# Altium schematic sheet Main Circuit Schematic.SchDoc
size A4; SheetNumber: 1; SheetTotal: 1
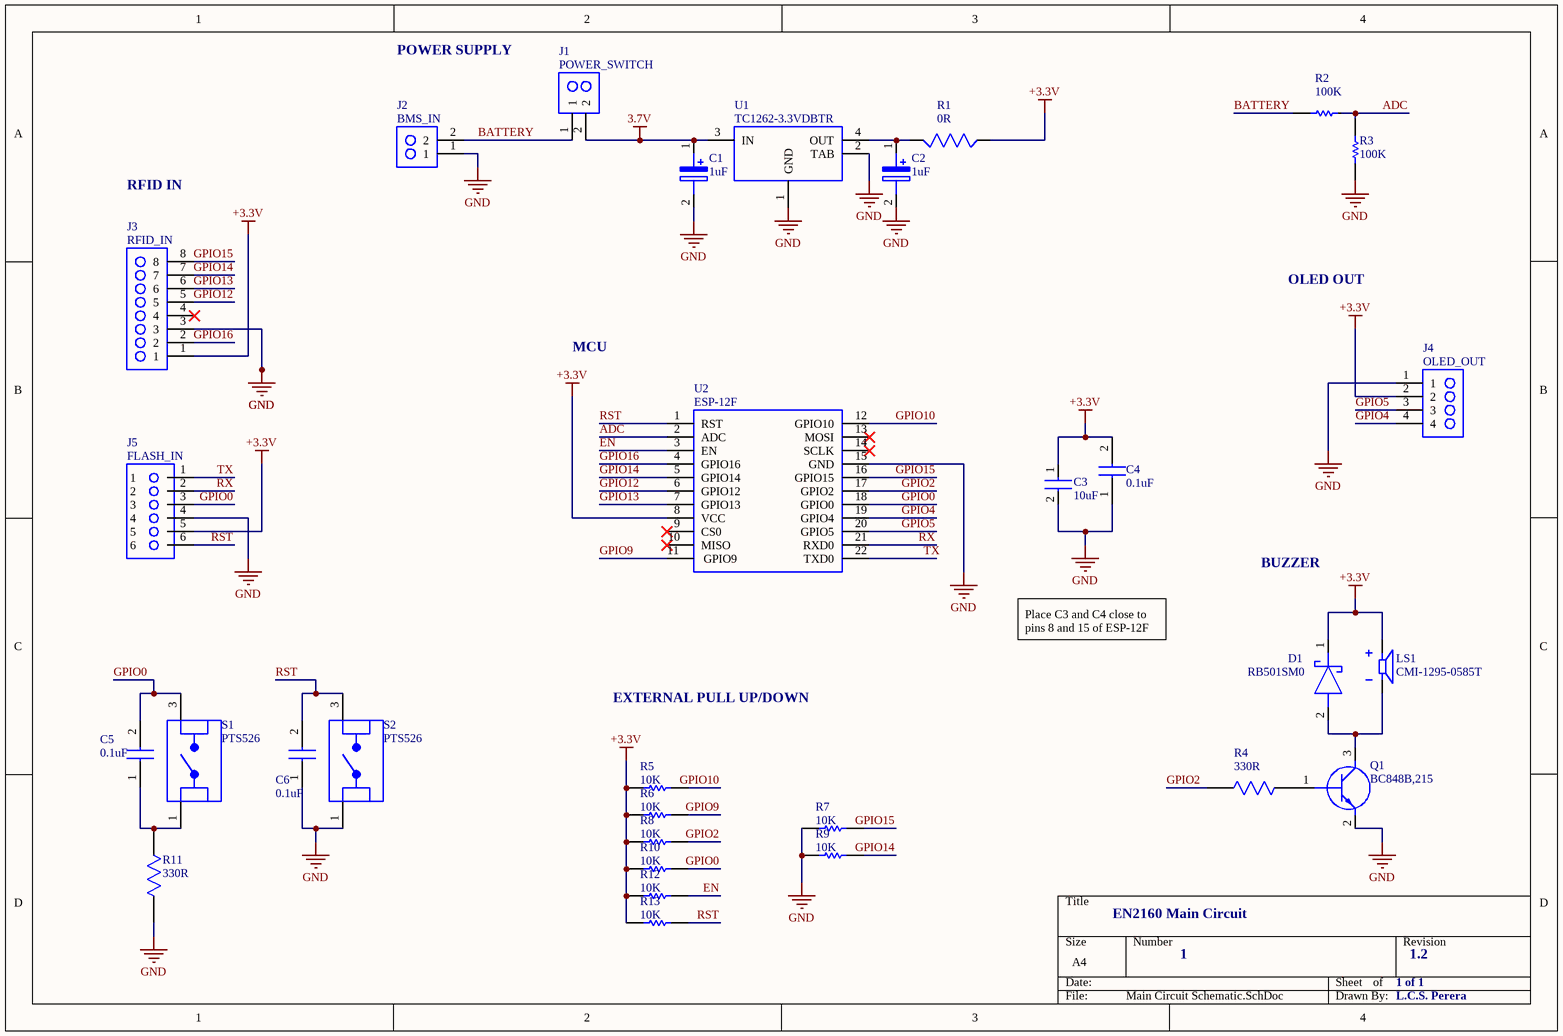
[diagram p0: Main Circuit Schematic.SchDoc]

## Parts
C1  1uF  [1U]
C2  1uF  [1U]
C3  10uF  [10ucer]
C4  0.1uF  [100n]
C5  0.1uF  [100n]
C6  0.1uF  [100n]
D1  RB501SM0  [Shottkey]
J1  POWER_SWITCH  [2jst]
J2  BMS_IN  [2jst]
J3  RFID_IN  [8x1]
J4  OLED_OUT  [4x1]
J5  FLASH_IN  [6x1]
LS1  CMI-1295-0585T  [BUZZER]
Q1  BC848B,215  [BC8488]
R1  0R  [0ohm]
R2  100K  [100k]
R3  100K  [100k]
R4  330R  [330r]
R5  10K  [10k]
R6  10K  [10k]
R7  10K  [10k]
R8  10K  [10k]
R9  10K  [10k]
R10  10K  [10k]
R11  330R  [330r]
R12  10K  [10k]
R13  10K  [10k]
S1  PTS526  [switch]
S2  PTS526  [switch]
U1  TC1262-3.3VDBTR  [3v3]
U2  ESP-12F  [esp12f]

## Nets
3.7V: C1.1(+) J1.2 U1.3(IN)
+3.3V: C3.1 C4.2 D1.1(K) J3.1 J4.2 J5.5 LS1.P R1.2 R5.1 R6.1 R8.1 R10.1 R12.1 R13.1 U2.8(VCC)
GND: C1.2(-) C2.2(-) C3.2 C4.1 C6.1 J2.1 J3.3 J4.1 J5.4 Q1.2(E) R3.1 R7.1 R9.1 R11.2 S2.1(COM_1) U1.1(GND) U1.2(TAB) U2.15(GND)
ADC: R2.1 R3.2 U2.2(ADC)
BATTERY: J1.1 J2.2 R2.2
EN: R12.2 U2.3(EN)
GPIO0: C5.2 J5.3 R10.2 S1.3(NO_1) U2.18(GPIO0)
GPIO2: R4.2 R8.2 U2.17(GPIO2)
GPIO4: J4.4 U2.19(GPIO4)
GPIO5: J4.3 U2.20(GPIO5)
GPIO9: R6.2 U2.11(GPIO9)
GPIO10: R5.2 U2.12(GPIO10)
GPIO12: J3.5 U2.6(GPIO12)
GPIO13: J3.6 U2.7(GPIO13)
GPIO14: J3.7 R9.2 U2.5(GPIO14)
GPIO15: J3.8 R7.2 U2.16(GPIO15)
GPIO16: J3.2 U2.4(GPIO16)
RST: C6.2 J5.6 R13.2 S2.3(NO_1) U2.1(RST)
RX: J5.2 U2.21(RXD0)
TX: J5.1 U2.22(TXD0)
NetC2_1: C2.1(+) R1.1 U1.4(OUT)
NetC5_1: C5.1 R11.1 S1.1(COM_1)
NetD1_2: D1.2(A) LS1.N Q1.3(C)
NetQ1_1: Q1.1(B) R4.1

Not connected (* = marked no-connect by the designer): J3 4*; U2 9(CS0)* 10(MISO)* 13(MOSI)* 14(SCLK)*

## Notes on the sheet
- POWER SUPPLY
- RFID IN
- OLED OUT
- MCU
- BUZZER
- Place C3 and C4 close to pins 8 and 15 of ESP-12F
- EXTERNAL PULL UP/DOWN
- EN2160 Main Circuit
- 1
- 1 of 1
- 1.2
- L.C.S. Perera

## Library data of the parts
C1 C2 = TAJA105K016RNJ: Capacitor Polarised; Manufacturer_Name: Kyocera AVX; Datasheet Link: http://www.farnell.com/datasheets/1680476.pdf; Height: 1.8mm; Manufacturer_Part_Number: TAJA105K016RNJ; Mouser Part Number: 581-TAJA105K016; Mouser Price/Stock: https://www.mouser.co.uk/ProductDetail/AVX/TAJA105K016RNJ?qs=OVpPYgiJXXWzOIbDvQCr4Q%3D%3D; Arrow Part Number: TAJA105K016RNJ; Arrow Price/Stock: https://www.arrow.com/en/products/taja105k016rnj/avx
C3 = 10uF: 10ÂµF Â±10% 10V Ceramic Capacitor X5R 0805 (2012 Metric); MF: Samsung Electro-Mechanics; MP: CL21A106KPFNNNG; SnapEDA_Link: https://www.snapeda.com/parts/CL21A106KPFNNNG/Samsung%20Electro-Mechanics/view-part/3598324/?ref=snap; Value: *; Arrow_Electronics-Purchase-URL: https://snapeda.com/shop?store=Arrow+Electronics&id=3598324; Digi-Key_Part_Number: 1276-6456-1-ND; Mouser-Purchase-URL: https://snapeda.com/shop?store=Mouser&id=3598324; Package: 0805 Samsung; DigiKey-Purchase-URL: https://snapeda.com/shop?store=DigiKey&id=3598324
C4-C6 = 0.1uF: Capacitor; Manufacturer_Name: KEMET; Manufacturer_Part_Number: C0603C104K1RACTU; Datasheet Link: https://search.kemet.com/component-documentation/download/specsheet/C0603C104K1RACTU; Height: 0.95mm; Mouser Part Number: 80-C0603C104K1RACTU; Mouser Price/Stock: https://www.mouser.co.uk/ProductDetail/KEMET/C0603C104K1RACTU?qs=ulEaXIWI0c%252BGZAOcX%252BBs5A%3D%3D
D1 = RB501SM-30: Schottky Diode; Manufacturer_Name: ROHM Semiconductor; Datasheet Link: https://www.rohm.com/products/diodes/schottky-barrier-diodes/ultra-low-vf/rb501sm-30-product; Height: 0.7mm; Manufacturer_Part_Number: RB501SM-30; Mouser Part Number: N/A; Mouser Price/Stock: https://www.mouser.co.uk/ProductDetail/ROHM-Semiconductor/RB501SM-30?qs=tlR8i4ZVbUc9OuTORAzjPQ%3D%3D
J1 J2 = B2B-XHALFSN_: Connector; Manufacturer_Name: JST (JAPAN SOLDERLESS TERMINALS); Manufacturer_Part_Number: B2B-XH-A(LF)(SN); Datasheet Link: http://www.jst-mfg.com/product/pdf/eng/eXH.pdf; Height: 7mm; Arrow Part Number: B2B-XH-A(LF)(SN); Arrow Price/Stock: https://www.arrow.com/en/products/b2b-xh-a-lf-sn/jst-manufacturing?region=europe
J3 = 61300811121: Connector; Manufacturer_Name: Wurth Elektronik; Datasheet Link: http://katalog.we-online.de/em/datasheet/6130xx11121.pdf; Height: 8.54mm; Manufacturer_Part_Number: 61300811121; Mouser Part Number: 710-61300811121; Mouser Price/Stock: https://www.mouser.co.uk/ProductDetail/Wurth-Elektronik/61300811121?qs=PhR8RmCirEZRdx%252BVlEmRRA%3D%3D
J4 = 4x1: GROVE 2MM 4PIN VERT CONN 10PCS; MP: 110990030; MF: Seeed Technology; Arrow_Electronics-Purchase-URL: https://snapeda.com/shop?store=Arrow+Electronics&id=583576; Availability: Good; Package: None; Price: None; Mouser-Purchase-URL: https://snapeda.com/shop?store=Mouser&id=583576; SnapEDA_Link: https://www.snapeda.com/parts/110990030/Seeed%20Technology%20Co.,%20Ltd/view-part/583576/?ref=snap; Value: *
J5 = PPTC061LFBN-RC: 6 Position Header Connector 0.100 (2.54mm) Through Hole Tin; MF: Sullins Connector; SnapEDA_Link: https://www.snapeda.com/parts/PPTC061LFBN-RC/Sullins+Connector+Solutions/view-part/?ref=snap; Package: None; Value: *; MP: PPTC061LFBN-RC; Check_prices: https://www.snapeda.com/parts/PPTC061LFBN-RC/Sullins+Connector+Solutions/view-part/?ref=eda
LS1 = CMI-1295-0585T: 12 mm, 5 Vdc, 85 dB, Through Hole, Driving Circuit, Magnetic Audio Indicator Buzzer; MF: CUI Devices; CUI_purchase_URL: https://www.cuidevices.com/product/audio/buzzers/audio-indicators/cmi-1295-0585t?utm_source=snapeda.com&utm_medium=referral&utm_campaign=snapedaBOM; Purchase-URL: https://pricing.snapeda.com/search/part/CMI-1295-0585T/?ref=eda; MP: CMI-1295-0585T; Package: CUI Inc.; Availability: In Stock; Value: *; SnapEDA_Link: https://www.snapeda.com/parts/CMI-1295-0585T/CUI+Devices/view-part/?ref=snap; Price: None; Check_prices: https://www.snapeda.com/parts/CMI-1295-0585T/CUI+Devices/view-part/?ref=eda
Q1 = BC848B,215: Transistor BJT NPN; Manufacturer_Name: Nexperia; Datasheet Link: https://assets.nexperia.com/documents/data-sheet/BC848_SER.pdf; Height: 1.1mm; Manufacturer_Part_Number: BC848B,215; Mouser Part Number: 771-BC848B215; Mouser Price/Stock: https://www.mouser.co.uk/ProductDetail/Nexperia/BC848B215?qs=me8TqzrmIYWVIx0akKpYzQ%3D%3D; Arrow Part Number: BC848B,215; Arrow Price/Stock: https://www.arrow.com/en/products/bc848b215/nexperia?region=nac
R1 = RC0805JR-070RL: 0 Ohms Jumper 0.125W, 1/8W Chip Resistor 0805 (2012 Metric) Moisture Resistant Thick Film; MF: Yageo; SnapEDA_Link: https://www.snapeda.com/parts/RC0805JR-070RL/Yageo/view-part/?ref=snap; Package: 0805 Yageo; Value: *; MP: RC0805JR-070RL; Check_prices: https://www.snapeda.com/parts/RC0805JR-070RL/Yageo/view-part/?ref=eda
R2 R3 = 100k: Resistor; Manufacturer_Name: Bourns; Manufacturer_Part_Number: CR0805-FX-1002ELF; Datasheet Link: https://www.bourns.com/pdfs/chpreztr.pdf; Height: 0.6mm; Mouser Part Number: 652-CR0805FX-1002ELF; Mouser Price/Stock: https://www.mouser.co.uk/ProductDetail/Bourns/CR0805-FX-1002ELF?qs=tknLyCMIRbPr%252BDD0s0nG9g%3D%3D; Arrow Part Number: CR0805-FX-1002ELF; Arrow Price/Stock: https://www.arrow.com/en/products/cr0805-fx-1002elf/bourns?region=nac
R4 R11 = CR0805-FX-3300ELF: Resistor; Manufacturer_Name: Bourns; Datasheet Link: https://www.bourns.com/pdfs/chpreztr.pdf; Height: 0.6mm; Manufacturer_Part_Number: CR0805-FX-3300ELF; Mouser Part Number: 652-CR0805FX-3300ELF; Mouser Price/Stock: https://www.mouser.co.uk/ProductDetail/Bourns/CR0805-FX-3300ELF?qs=4vGXhLEMbUz19Gzwl%252BfkPA%3D%3D; Arrow Part Number: CR0805-FX-3300ELF; Arrow Price/Stock: https://www.arrow.com/en/products/cr0805-fx-3300elf/bourns?region=nac
R5-R10 R12 R13 = 10k: Resistor; Manufacturer_Name: Bourns; Manufacturer_Part_Number: CR0805-FX-1002ELF; Datasheet Link: https://www.bourns.com/pdfs/chpreztr.pdf; Height: 0.6mm; Mouser Part Number: 652-CR0805FX-1002ELF; Mouser Price/Stock: https://www.mouser.co.uk/ProductDetail/Bourns/CR0805-FX-1002ELF?qs=tknLyCMIRbPr%252BDD0s0nG9g%3D%3D; Arrow Part Number: CR0805-FX-1002ELF; Arrow Price/Stock: https://www.arrow.com/en/products/cr0805-fx-1002elf/bourns?region=nac
S1 S2 = PTS526-SK15-SMTR2-LFS: Switch; Manufacturer_Name: C & K COMPONENTS; Manufacturer_Part_Number: PTS526 SK15 SMTR2 LFS; Datasheet Link: https://www.ckswitches.com/media/2780/pts526.pdf; Height: 1.65mm; Mouser Part Number: 611-PTS526SK15SMR2L; Mouser Price/Stock: https://www.mouser.co.uk/ProductDetail/CK/PTS526-SK15-SMTR2-LFS?qs=UXgszm6BlbF5Ezp94JAQtw%3D%3D; Arrow Part Number: PTS526 SK15 SMTR2 LFS; Arrow Price/Stock: https://www.arrow.com/en/products/pts526-sk15-smtr2-lfs/ck?region=nac
U1 = LM1117-3.3MDCNOPB: Integrated Circuit; pin to pad: 1>2 2>4 3>1 4>3; Manufacturer_Name: Texas Instruments; Manufacturer_Part_Number: LM1117-3.3 MDC/NOPB; Datasheet Link: http://www.ti.com/lit/ds/symlink/lm1117.pdf?HQS=TI-null-null-mousermode-df-pf-null-wwe&DCM=yes&ref_url=https%3A%2F%2Fwww.mouser.in%2F&distId=26; Height: 1.8mm; Mouser Part Number: N/A; Mouser Price/Stock: https://www.mouser.co.uk/ProductDetail/Texas-Instruments/LM1117-3.3-MDC-NOPB?qs=Ek1QeT%2FBOW0pQDUjkXKTEQ%3D%3D
U2 = ESP-12F: Integrated Circuit; Manufacturer_Name: Ai-Thinker; Datasheet Link: https://docs.ai-thinker.com/_media/esp8266/docs/esp-12f_product_specification_en.pdf; Height: 3.1mm; Manufacturer_Part_Number: esp-12f